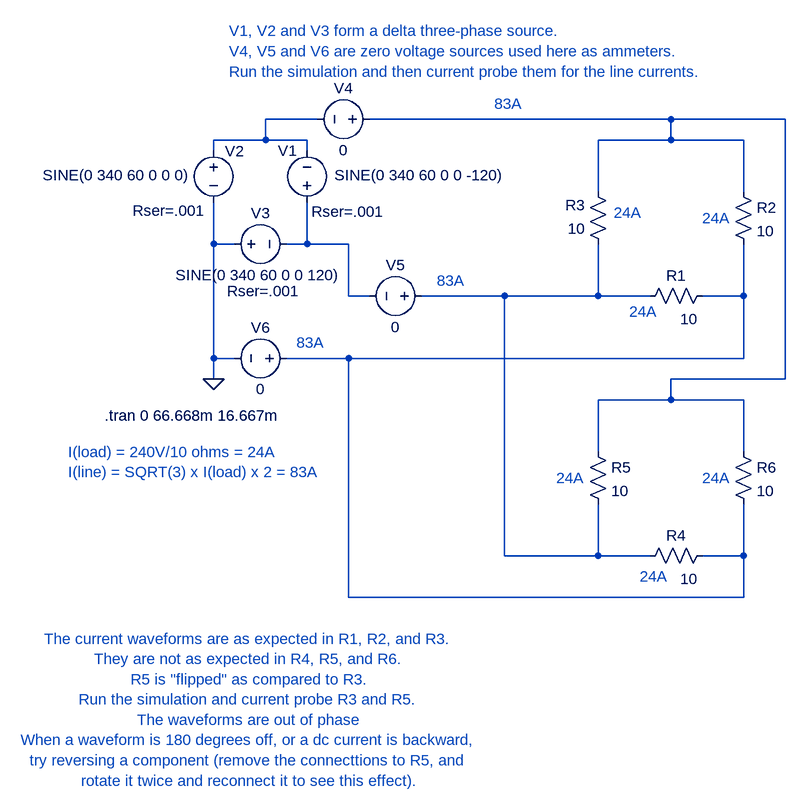
[diagram p0: schematic 3PhaseA.asc]
3PhaseA.asc, the LTspice schematic file:
Version 4
SHEET 1 880 1252
WIRE -448 -208 -528 -208
WIRE 96 -208 -368 -208
WIRE 272 -208 96 -208
WIRE -528 -176 -528 -208
WIRE -528 -176 -608 -176
WIRE -464 -176 -528 -176
WIRE 96 -176 96 -208
WIRE 96 -176 -16 -176
WIRE 208 -176 96 -176
WIRE -608 -160 -608 -176
WIRE -464 -160 -464 -176
WIRE -16 -96 -16 -176
WIRE 208 -96 208 -176
WIRE -608 -16 -608 -80
WIRE -576 -16 -608 -16
WIRE -464 -16 -464 -80
WIRE -464 -16 -496 -16
WIRE -400 -16 -464 -16
WIRE -400 64 -400 -16
WIRE -368 64 -400 64
WIRE -160 64 -288 64
WIRE -16 64 -16 -16
WIRE -16 64 -160 64
WIRE 64 64 -16 64
WIRE 208 64 208 -16
WIRE 208 64 144 64
WIRE -608 160 -608 -16
WIRE -576 160 -608 160
WIRE -400 160 -496 160
WIRE 208 160 208 64
WIRE 208 160 -400 160
WIRE -608 192 -608 160
WIRE 272 192 272 -208
WIRE 272 192 96 192
WIRE 96 224 96 192
WIRE 96 224 -16 224
WIRE 208 224 96 224
WIRE -16 304 -16 224
WIRE 208 304 208 224
WIRE -160 464 -160 64
WIRE -16 464 -16 384
WIRE -16 464 -160 464
WIRE 64 464 -16 464
WIRE 208 464 208 384
WIRE 208 464 144 464
WIRE -400 528 -400 160
WIRE 208 528 208 464
WIRE 208 528 -400 528
FLAG -608 192 0
SYMBOL voltage -608 -176 R0
WINDOW 0 99 16 Left 2
WINDOW 3 -263 54 Left 2
WINDOW 123 0 0 Left 2
WINDOW 39 -125 109 Left 2
SYMATTR InstName V1
SYMATTR Value SINE(0 340 60 0 0 0)
SYMATTR SpiceLine Rser=.001
SYMBOL voltage -464 -64 R180
WINDOW 0 97 95 Left 2
WINDOW 3 -305 58 Left 2
WINDOW 123 0 0 Left 2
WINDOW 39 -119 2 Left 2
SYMATTR InstName V2
SYMATTR Value SINE(0 340 60 0 0 -120)
SYMATTR SpiceLine Rser=.001
SYMBOL voltage -592 -16 R270
WINDOW 0 32 56 VTop 2
WINDOW 3 -32 53 VBottom 2
WINDOW 123 0 0 Left 2
WINDOW 39 -88 61 VTop 2
SYMATTR InstName V3
SYMATTR Value SINE(0 340 60 0 0 120)
SYMATTR SpiceLine Rser=.001
SYMBOL res 160 48 R90
WINDOW 0 0 56 VBottom 2
WINDOW 3 36 36 VTop 2
SYMATTR InstName R1
SYMATTR Value 10
SYMBOL res 0 0 R180
WINDOW 0 36 76 Left 2
WINDOW 3 36 40 Left 2
SYMATTR InstName R3
SYMATTR Value 10
SYMBOL res 192 -112 R0
SYMATTR InstName R2
SYMATTR Value 10
SYMBOL voltage -352 -208 R90
WINDOW 0 -32 56 VBottom 2
WINDOW 3 32 56 VTop 2
WINDOW 123 0 0 Left 2
WINDOW 39 0 0 Left 2
SYMATTR InstName V4
SYMATTR Value 0
SYMBOL voltage -272 64 R90
WINDOW 0 -32 56 VBottom 2
WINDOW 3 32 56 VTop 2
WINDOW 123 0 0 Left 2
WINDOW 39 0 0 Left 2
SYMATTR InstName V5
SYMATTR Value 0
SYMBOL voltage -480 160 R90
WINDOW 0 -32 56 VBottom 2
WINDOW 3 32 56 VTop 2
WINDOW 123 0 0 Left 2
WINDOW 39 0 0 Left 2
SYMATTR InstName V6
SYMATTR Value 0
SYMBOL res 160 448 R90
WINDOW 0 0 56 VBottom 2
WINDOW 3 36 36 VTop 2
SYMATTR InstName R4
SYMATTR Value 10
SYMBOL res -32 288 R0
SYMATTR InstName R5
SYMATTR Value 10
SYMBOL res 192 288 R0
SYMATTR InstName R6
SYMATTR Value 10
TEXT -776 248 Left 2 !.tran 0 66.668m 16.667m
TEXT -584 -344 Left 2 ;V1, V2 and V3 form a delta three-phase source.\nV4, V5 and V6 are zero voltage sources used here as ammeters.\nRun the simulation and then current probe them for the line currents.
TEXT -552 576 Top 2 ;The current waveforms are as expected in R1, R2, and R3.\nThey are not as expected in R4, R5, and R6.\nR5 is "flipped" as compared to R3.\nRun the simulation and current probe R3 and R5.\nThe waveforms are out of phase\nWhen a waveform is 180 degrees off, or a dc current is backward,\ntry reversing a component (remove the connecttions to R5, and\nrotate it twice and reconnect it to see this effect).
TEXT -832 304 Left 2 ;I(load) = 240V/10 ohms = 24A\nI(line) = SQRT(3) x I(load) x 2 = 83A
TEXT -176 -232 Left 2 ;83A
TEXT -264 40 Left 2 ;83A
TEXT -480 136 Left 2 ;83A
TEXT 8 -64 Left 2 ;24A
TEXT 144 -56 Left 2 ;24A
TEXT 32 88 Left 2 ;24A
TEXT -80 344 Left 2 ;24A
TEXT 144 344 Left 2 ;24A
TEXT 48 496 Left 2 ;24A

The netlist it stands for:
* 3PhaseA.asc
V1 N001 0 SINE(0 340 60 0 0 0) Rser=.001
V2 N003 N001 SINE(0 340 60 0 0 -120) Rser=.001
V3 0 N003 SINE(0 340 60 0 0 120) Rser=.001
R1 N005 N004 10
R3 N004 N002 10
R2 N002 N005 10
V4 N002 N001 0
V5 N004 N003 0
V6 N005 0 0
R4 N005 N004 10
R5 N002 N004 10
R6 N002 N005 10
.tran 0 66.668m 16.667m
* V1, V2 and V3 form a delta three-phase source.
* V4, V5 and V6 are zero voltage sources used here as ammeters.
* Run the simulation and then current probe them for the line currents.
* The current waveforms are as expected in R1, R2, and R3.
* They are not as expected in R4, R5, and R6.
* R5 is "flipped" as compared to R3.
* Run the simulation and current probe R3 and R5.
* The waveforms are out of phase
* When a waveform is 180 degrees off, or a dc current is backward,
* try reversing a component (remove the connecttions to R5, and
* rotate it twice and reconnect it to see this effect).
* I(load) = 240V/10 ohms = 24A
* I(line) = SQRT(3) x I(load) x 2 = 83A
* 83A
* 83A
* 83A
* 24A
* 24A
* 24A
* 24A
* 24A
* 24A
.backanno
.end